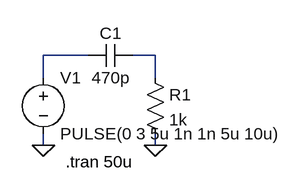
[diagram p0: schematic Draft3.asc]
Draft3.asc, the LTspice schematic file:
Version 4
SHEET 1 880 680
WIRE 128 128 64 128
WIRE 224 128 192 128
WIRE 64 160 64 128
WIRE 224 160 224 128
WIRE 64 256 64 240
WIRE 224 256 224 240
FLAG 64 256 0
FLAG 224 256 0
SYMBOL voltage 64 144 R0
WINDOW 123 0 0 Left 0
WINDOW 39 0 0 Left 0
SYMATTR InstName V1
SYMATTR Value PULSE(0 3 5u 1n 1n 5u 10u)
SYMBOL cap 192 112 R90
WINDOW 0 0 32 VBottom 2
WINDOW 3 32 32 VTop 2
SYMATTR InstName C1
SYMATTR Value 470p
SYMBOL res 208 144 R0
SYMATTR InstName R1
SYMATTR Value 1k
TEXT 96 280 Left 2 !.tran 50u

The netlist it stands for:
* Draft3.asc
V1 N001 0 PULSE(0 3 5u 1n 1n 5u 10u)
C1 N002 N001 470p
R1 N002 0 1k
.tran 50u
.backanno
.end